# EAGLE design bipolar-supply (EAGLE 9.6.2)
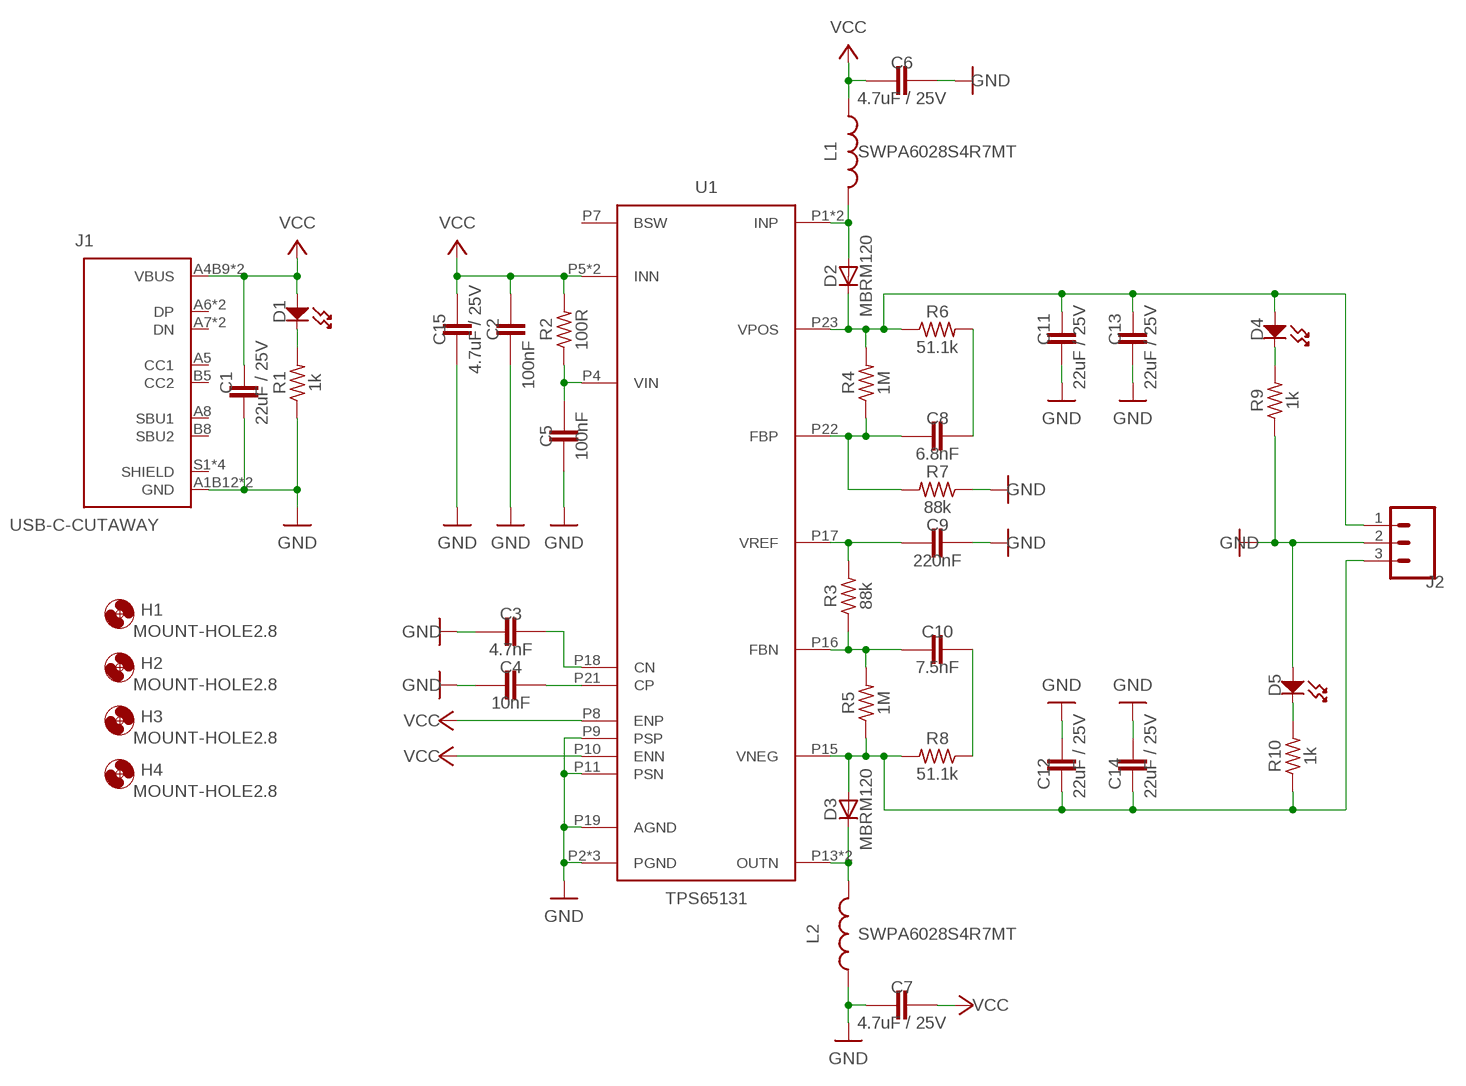
[diagram p0: schematic, sheet 1]

## Parts
C1  22uF / 25V  C-EUC0805  [C0805]
C2  100nF  CAPACITOR-0402  [C0402]
C3  4.7nF  CAPACITOR-0402  [C0402]
C4  10nF  CAPACITOR-0402  [C0402]
C5  100nF  CAPACITOR-0402  [C0402]
C6  4.7uF / 25V  CAPACITOR-0402  [C0402]
C7  4.7uF / 25V  CAPACITOR-0402  [C0402]
C8  6.8nF  CAPACITOR-0402  [C0402]
C9  220nF  CAPACITOR-0402  [C0402]
C10  7.5nF  CAPACITOR-0402  [C0402]
C11  22uF / 25V  C-EUC0805  [C0805]
C12  22uF / 25V  C-EUC0805  [C0805]
C13  22uF / 25V  C-EUC0805  [C0805]
C14  22uF / 25V  C-EUC0805  [C0805]
C15  4.7uF / 25V  CAPACITOR-0402  [C0402]
D1  LED_SINGLE-0603  [LED0603]
D2  MBRM120  [POWERMITE]
D3  MBRM120  [POWERMITE]
D4  LED_SINGLE-0603  [LED0603]
D5  LED_SINGLE-0603  [LED0603]
H1  MOUNT-HOLE2.8  [2,8]
H2  MOUNT-HOLE2.8  [2,8]
H3  MOUNT-HOLE2.8  [2,8]
H4  MOUNT-HOLE2.8  [2,8]
J1  USB-C-CUTAWAY  [918-418K2024S40000]
J2  CONN_03-SCREW-5MM  [SCREWTERMINAL-5MM-3]
L1  SWPA6028S4R7MT  L-USWE-TPC  [POWER-CHOKE_WE-TPC]
L2  SWPA6028S4R7MT  L-USWE-TPC  [POWER-CHOKE_WE-TPC]
R1  1k  R-US_R0402  [R0402]
R2  100R  R-US_R0402  [R0402]
R3  88k  R-US_R0402  [R0402]
R4  1M  R-US_R0402  [R0402]
R5  1M  R-US_R0402  [R0402]
R6  51.1k  R-US_R0402  [R0402]
R7  88k  R-US_R0402  [R0402]
R8  51.1k  R-US_R0402  [R0402]
R9  1k  R-US_R0402  [R0402]
R10  1k  R-US_R0402  [R0402]
U1  TPS65131  [QFN24-4X4-2]

## Nets
GND: C1.2 C2.1 C3.2 C4.1 C5.2 C6.1 C7.2 C9.1 C11.2 C12.2 C13.2 C14.2 C15.1 D5.ANODE J1.A1B12(GND) J1.B1A12(GND) J2.2 L2.2 R1.1 R7.1 R9.1 U1.P2(PGND) U1.P3(PGND) U1.P9(PSP) U1.P11(PSN) U1.P19(AGND) U1.PAD(PGND)
N$1: D1.CATHODE R1.2
N$2: D4.CATHODE R9.2
N$3: D2.P$2(A) L1.2 U1.P1(INP) U1.P24(INP)
N$5: D5.CATHODE R10.2
N$6: C11.1 C13.1 D2.P$1(C) D4.ANODE J2.1 R4.2 R6.1 U1.P23(VPOS)
N$7: C8.2 R6.2
N$8: C10.1 R3.1 R5.2 U1.P16(FBN)
N$9: C9.2 R3.2 U1.P17(VREF)
N$10: C8.1 R4.1 R7.2 U1.P22(FBP)
N$11: C10.2 R8.1
N$13: C12.1 C14.1 D3.P$2(A) J2.3 R5.1 R8.2 R10.1 U1.P15(VNEG)
N$14: C4.2 U1.P21(CP)
N$15: C3.1 U1.P18(CN)
N$16: C5.1 R2.1 U1.P4(VIN)
N$17: D3.P$1(C) L2.1 U1.P13(OUTN) U1.P14(OUTN)
VCC: C1.1 C2.2 C6.2 C7.1 C15.2 D1.ANODE J1.A4B9(VBUS) J1.B4A9(VBUS) L1.1 R2.2 U1.P5(INN) U1.P6(INN) U1.P8(ENP) U1.P10(ENN)
Unconnected: J1.A5(CC1) J1.A6(DP) J1.A7(DN) J1.A8(SBU1) J1.B5(CC2) J1.B6(DP) J1.B7(DN) J1.B8(SBU2) J1.S1(SHIELD) J1.S2(SHIELD) J1.S3(SHIELD) J1.S4(SHIELD) U1.P7(BSW)

## Library data of the parts
C1 C11-C14 = rcl:C-EU: CAPACITOR, European symbol; SPICEPREFIX: C
C2-C10 C15 = Components:CAPACITOR
D1 D4 D5 = MF_LEDs:LED_SINGLE: Library: MF_LEDs Description: Device for Single LED Packages. Manufacture part number (MFG#) can be added via Attributes.; HOUSEPART: NO; POPULATE: 1
D2 D3 = sonik:MBRM120
H1-H4 = holes:MOUNT-HOLE: MOUNTING HOLE with drill center marker
J1 = sonik:USB-C-CUTAWAY
J2 = SparkFun-Connectors:CONN_03: Multi connection point. Often used as Generic Header-pin footprint for 0.1 inch spaced/style header connections On any of the 0.1 inch spaced packages, you can populate with these: Break Away Headers - Straight <https://www.sparkfun.com/products/116> (PRT-00116) Break Away Male Headers - Right Angle <https://www.sparkfun.com/products/553> (PRT-00553) Female Headers <https://www.sparkfun.com/products/115> (PRT-00115) Break Away Headers - Machine Pin <https://www.sparkfun.com/products/117> (PRT-00117) Break Away Female Headers - Swiss Machine Pin <https://www.sparkfun.com/products/743> (PRT-00743) Stackable Header - 3 Pin (Female, 0.1") <https://www.sparkfun.com/products/13875> (PRT-13875) For SCREWTERMINALS and SPRING TERMINALS visit here: Screw Terimnals on SparkFun.com <https://www.sparkfun.com/search/results?term=Screw+Terminals> (5mm/3.5mm/2.54mm spacing) This device is also useful as a general connection point to wire up your design to another part of your project. Our various solder wires solder well into these plated through hole pads. Hook-Up Wire - Assortment (Stranded, 22 AWG) <https://www.sparkfun.com/products/11375> (PRT-11375) Hook-Up Wire - Assortment (Solid Core, 22 AWG) <https://www.sparkfun.com/products/11367> (PRT-11367) View the entire wire category on our website here <https://www.sparkfun.com/categories/141> Special notes: Molex polarized connector foot print use with SKU : PRT-08232 with associated crimp pins and housings.; PROD_ID: CONN-10134; SF_SKU: PRT-08433
L1 L2 = rcl:L-US: INDUCTOR, American symbol; SPICEPREFIX: L
R1-R10 = rcl:R-US_: RESISTOR, American symbol; SPICEPREFIX: R
U1 = sonik:TPS65131

## Board
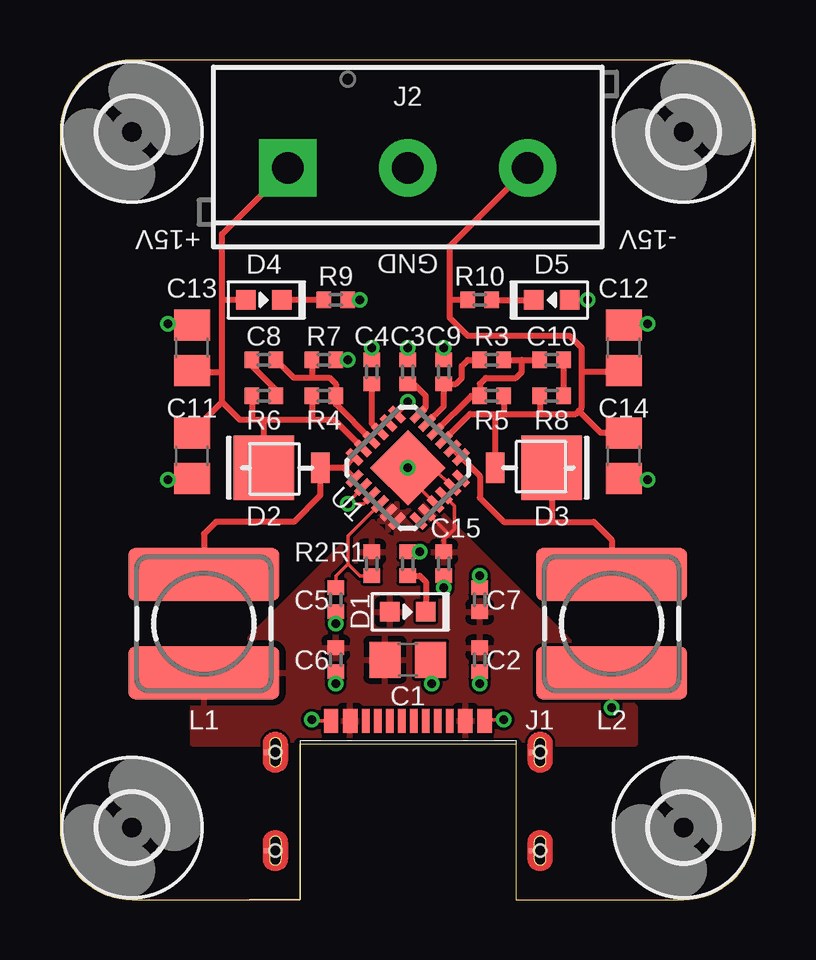
[diagram p1: board, top side]
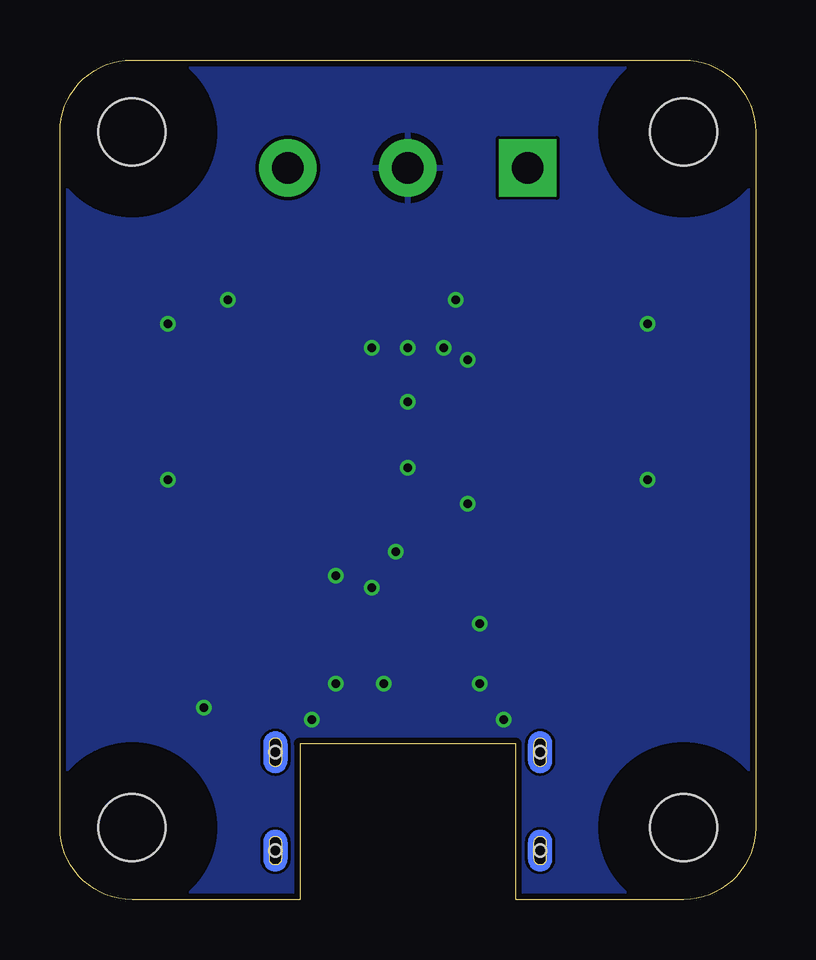
[diagram p2: board, bottom side, seen from below]

Size 29 x 35 mm. Coordinates in mm from the lower left corner, seen from the top.
Outline: 26,35 3,35 arc90 0,32 0,3 arc90 3,0 10,0 10,6.5 19,6.5 19,0 26,0 arc90 29,3 29,32 arc90 26,35
Copper layers (1*16): Top 0.035mm / dielectric 1.5mm / Bottom 0.035mm
Design rules "MF_Standard_2_Layer": minimum track width 5mil, minimum drill 12mil, track to track 5mil, track to pad 5mil, pad to pad 5mil, via to via 5mil, smd to smd 0mil, copper to edge 10mil, drill to drill 10mil, minimum pad ring 6mil, minimum via ring 6mil, stop-mask expansion 2mil, vias tented up to drill 25mil, thermal gap 10mil

### Footprints (pad centres in the part's own frame; a part is rotated, then mirrored left to right if it is on the bottom)
C0805 = smd 1.3 x 1.5: 1 -0.95,0; 2 0.95,0
C0402 = smd 0.6 x 0.7: 1 -0.5,0; 2 0.5,0
LED0603 = smd 0.8 x 0.8: ANODE 0.75,0; CATHODE -0.75,0
POWERMITE = smd 2.54 x 2.67: P$1 0,0 | smd 0.762 x 1.27: P$2 2.351,0
2,8 = hole 2.8: 0,0
918-418K2024S40000 = smd 0.6 x 1: A1B12 -3.2,3.456; A4B9 -2.4,3.456; B1A12 3.2,3.456; B4A9 2.4,3.456 | smd 0.3 x 1: A5 -1.25,3.456; A6 -0.25,3.456; A7 0.25,3.456; A8 1.25,3.456; B5 1.75,3.456; B6 0.75,3.456; B7 -0.75,3.456; B8 -1.75,3.456 | smd 0.2 x 0.2: S1 -5.895,2.14; S2 5.145,2.14; S3 -5.895,-1.96; S4 5.145,-1.96 | hole 0.5: -5.52,2.14; 5.52,2.14; -5.52,-1.96; 5.52,-1.96
SCREWTERMINAL-5MM-3 = drill 1.3 pad 2.413 square: 1 0,0 | drill 1.3 pad 2.413: 2 5,0; 3 10,0
POWER-CHOKE_WE-TPC = smd 6.3 x 2.2: 1 0,2.05; 2 0,-2.05
R0402 = smd 0.6 x 0.7: 1 -0.5,0; 2 0.5,0
QFN24-4X4-2 = smd 0.75 x 0.3: P1 -1.885,1.25; P2 -1.885,0.75; P3 -1.885,0.25; P4 -1.885,-0.25; P5 -1.885,-0.75; P6 -1.885,-1.25; P13 1.885,-1.25; P14 1.885,-0.75; P15 1.885,-0.25; P16 1.885,0.25; P17 1.885,0.75; P18 1.885,1.25 | smd 0.3 x 0.75: P7 -1.25,-1.885; P8 -0.75,-1.885; P9 -0.25,-1.885; P10 0.25,-1.885; P11 0.75,-1.885; P12 1.25,-1.885; P19 1.25,1.885; P20 0.75,1.885; P21 0.25,1.885; P22 -0.25,1.885; P23 -0.75,1.885; P24 -1.25,1.885 | smd 2.22 x 2.22: PAD 0,0

### Placement (x,y rotation side)
C1  14.5,10 0 top
C2  17.5,10 90 top
C3  14.5,22 90 top
C4  13,22 270 top
C5  11.5,12.5 270 top
C6  11.5,10 90 top
C7  17.5,12.5 90 top
C8  8.5,22.5 180 top
C9  16,22 270 top
C10  20.5,22.5 0 top
C11  5.5,18.5 270 top
C12  23.5,23 90 top
C13  5.5,23 90 top
C14  23.5,18.5 270 top
C15  16,14 90 top
D1  14.5,12 180 top
D2  8.5,18 0 top
D3  20.5,18 180 top
D4  8.5,25 180 top
D5  20.5,25 0 top
H1  3,3 0 top
H2  26,3 0 top
H3  3,32 0 top
H4  26,32 0 top
J1  14.5,4 0 top
J2  9.5,30.5 0 top
L1  6,11.5 180 top
L2  23,11.5 0 top
R1  14.5,14 270 top
R2  13,14 90 top
R3  18,22.5 180 top
R4  11,21 180 top
R5  18,21 180 top
R6  8.5,21 0 top
R7  11,22.5 180 top
R8  20.5,21 180 top
R9  11.5,25 180 top
R10  17.5,25 0 top
U1  14.5,18 45 top

### Tracks (layer width: path | path; a pad name or v marks a point on that pad's centre or on a via)
GND  (via drill 0.35)
  Top 0.152: C3.2 v14.5,23 | C9.1 v16,23 | C4.1 v13,23 | R7.1 v12,22.5 | R9.1 v12.5,25 | C13.2 5.45,24 v4.5,24 | C11.2 4.55,17.55 v4.5,17.5 | L2.2 v23,8 | J1.B1A12 17.74,7.5 v18.5,7.5 | J1.A1B12 10.54,7.46 v10.5,7.5 | C6.1 v11.5,9 | C2.1 v17.5,9 | C1.2 15.5,9.95 v15.5,9 | C5.2 v11.5,11.5 | C7.2 v17.5,13.5 | C14.2 24.45,17.55 v24.5,17.5 | C12.2 24.45,23.95 v24.5,24 | D5.ANODE v22,25 | U1.P19 14.5,20.67 v14.5,20.75 | U1.P9 14.5,17.65 U1.PAD 15.56,18 U1.P11 | U1.P3 12.65,16.5 v12,16.5 12,16.56 U1.P2 | R1.1 v15,14.5
  Top 0.254: C15.1 v16,13
  other vias: 14.5,18
  pour Bottom: 0,0 29,0 29,35 0,35
N$1
  Top 0.254: R1.2 15,13.5 15.25,13.25 D1.CATHODE
N$2
  Top 0.254: R9.2 D4.CATHODE
N$3
  Top 0.254: U1.P24 11.83,18 | 11.83,18 | 11.83,18 D2.P$2 10.85,16.85 9.75,15.75 6.5,15.75 6,15.25 L1.2 | U1.P1 11.83,18
N$5
  Top 0.254: R10.2 D5.CATHODE
N$6
  Top 0.254: U1.P23 11.44,20 10.5,20 | 10.5,20 8.5,20 | 8.5,20 8,20 | 8,20 7.5,20 6.75,20.75 | 5.5,22 C13.1 5.55,22 6.75,22 | D2.P$1 8.5,20 | R6.1 8,20 | R4.2 10.5,20 | J2.1 6.75,27.75 6.75,25 | 6.75,20.75 6.75,22 | 6.75,22 6.75,25 | D4.ANODE 6.75,25 | C11.1 5.5,19.5 6.75,20.75
N$7
  Top 0.254: C8.2 8,22.25 9,21.25 R6.2
N$8
  Top 0.254: U1.P16 17.15,21 R5.2 17.5,21.5 17.75,21.75 19,21.75 19.25,22 19.25,22.5 | R3.1 19.25,22.5 | 19.25,22.5 C10.1
N$9
  Top 0.254: U1.P17 16,20.56 C9.2 16.5,21.5 16.75,21.75 16.75,22.25 17,22.5 R3.2
N$10
  Top 0.254: U1.P22 11.5,20.65 R4.1 11.5,21.49 11.24,21.75 10.5,21.75 | C8.1 9.75,21.75 10.5,21.75 | R7.2 10.5,21.75
N$11
  Top 0.254: R8.1 C10.2
N$13
  Top 0.254: U1.P15 17.1,20.25 18.25,20.25 | 18.25,20.25 18.5,20.25 | 18.5,20.25 20,20.25 | 20,20.25 21.5,20.25 21.62,20.38 | 21.62,20.38 21.75,20.5 21.75,22 | 21.75,22 21.75,23 21.25,23.5 17,23.5 16.25,24.25 16.25,25 | J2.3 16.25,27.25 16.25,25 | R10.1 16.25,25 | C12.1 23.45,22 21.75,22 | C14.1 22.55,19.45 21.62,20.38 | R8.2 20,20.25 | R5.1 18.5,20.25 | D3.P$2 18.15,20.15 18.25,20.25
N$14
  Top 0.254: U1.P21 13,19.85 C4.2
N$15
  Top 0.254: U1.P18 15.25,20.52 15.25,21 14.75,21.5 C3.1
N$16
  Top 0.152: U1.P4 12,15.15 12,14 | 12,14 12.5,13.5 R2.1 | C5.1 11.5,13.5 12,14
N$17
  Top 0.254: U1.P14 U1.P13 17.5,17.67 17.5,16.75 18.5,15.75 20.5,15.75 | L2.1 23,15 22.25,15.75 20.5,15.75 | D3.P$1 20.5,15.75
VCC
  Top 0.152: U1.P8 16.22,15.22 | C15.2 16,14.94 15.97,14.97 16.22,15.22 | U1.P10 16.46,16.4 16.46,15.46 16.22,15.22
  pour Top: 5.5,6.5 24,6.5 24,8 15.5,16.5 13.5,16.5 5.5,8.5

### Text on the board
tPlace: +15V | -15V | GND